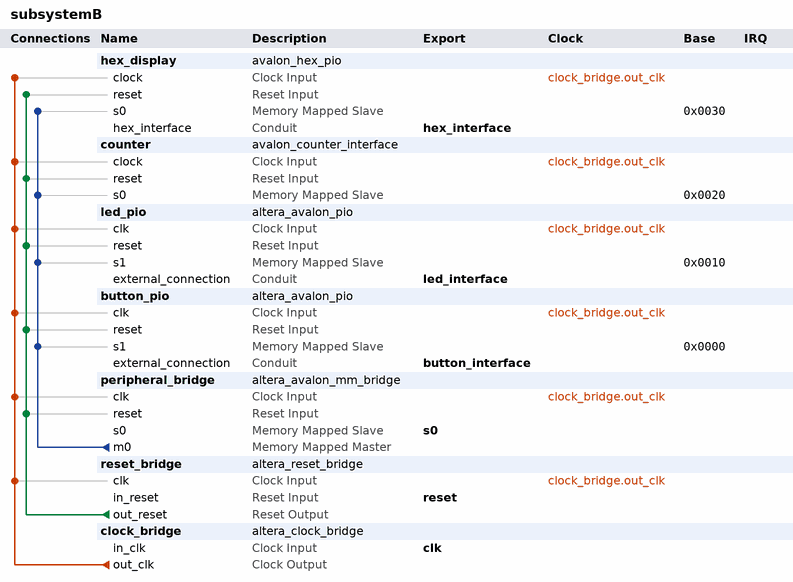
[diagram p0: system contents]
# Platform Designer (Qsys) system subsystemB, MAX 10 10M50DAF484C7G
# Parameters at their usual value, and those the tool derives, are not listed.
package require -exact qsys 18.1
create_system subsystemB
set_project_property DEVICE_FAMILY {MAX 10}
set_project_property DEVICE 10M50DAF484C7G

add_instance hex_display avalon_hex_pio 1.0

add_instance counter avalon_counter_interface 1.0
set_instance_parameter_value counter INITIAL_MAX_COUNT 100
set_instance_parameter_value counter INITIAL_SPEED 5000000

add_instance led_pio altera_avalon_pio 18.1
set_instance_parameter_value led_pio direction Output
set_instance_parameter_value led_pio width 1

add_instance button_pio altera_avalon_pio 18.1
set_instance_parameter_value button_pio direction Input
set_instance_parameter_value button_pio width 2

add_instance peripheral_bridge altera_avalon_mm_bridge 18.1
set_instance_parameter_value peripheral_bridge ADDRESS_UNITS SYMBOLS
set_instance_parameter_value peripheral_bridge ADDRESS_WIDTH 10
set_instance_parameter_value peripheral_bridge DATA_WIDTH 32
set_instance_parameter_value peripheral_bridge MAX_PENDING_RESPONSES 4
set_instance_parameter_value peripheral_bridge USE_AUTO_ADDRESS_WIDTH 0

add_instance reset_bridge altera_reset_bridge 18.1
set_instance_parameter_value reset_bridge ACTIVE_LOW_RESET 0
set_instance_parameter_value reset_bridge SYNCHRONOUS_EDGES deassert

add_instance clock_bridge altera_clock_bridge 18.1
set_instance_parameter_value clock_bridge DERIVED_CLOCK_RATE 0
set_instance_parameter_value clock_bridge EXPLICIT_CLOCK_RATE 0

# connections
add_connection clock_bridge.out_clk button_pio.clk clock
add_connection clock_bridge.out_clk counter.clock clock
add_connection clock_bridge.out_clk hex_display.clock clock
add_connection clock_bridge.out_clk led_pio.clk clock
add_connection clock_bridge.out_clk peripheral_bridge.clk clock
add_connection clock_bridge.out_clk reset_bridge.clk clock
add_connection reset_bridge.out_reset button_pio.reset reset
add_connection reset_bridge.out_reset counter.reset reset
add_connection reset_bridge.out_reset hex_display.reset reset
add_connection reset_bridge.out_reset led_pio.reset reset
add_connection reset_bridge.out_reset peripheral_bridge.reset reset
add_connection peripheral_bridge.m0 button_pio.s1 avalon
set_connection_parameter_value peripheral_bridge.m0/button_pio.s1 baseAddress 0x0000
add_connection peripheral_bridge.m0 counter.s0 avalon
set_connection_parameter_value peripheral_bridge.m0/counter.s0 baseAddress 0x0020
add_connection peripheral_bridge.m0 hex_display.s0 avalon
set_connection_parameter_value peripheral_bridge.m0/hex_display.s0 baseAddress 0x0030
add_connection peripheral_bridge.m0 led_pio.s1 avalon
set_connection_parameter_value peripheral_bridge.m0/led_pio.s1 baseAddress 0x0010

# exported interfaces
add_interface button_interface conduit end
set_interface_property button_interface EXPORT_OF button_pio.external_connection
add_interface clk clock sink
set_interface_property clk EXPORT_OF clock_bridge.in_clk
add_interface hex_interface conduit end
set_interface_property hex_interface EXPORT_OF hex_display.hex_interface
add_interface led_interface conduit end
set_interface_property led_interface EXPORT_OF led_pio.external_connection
add_interface reset reset sink
set_interface_property reset EXPORT_OF reset_bridge.in_reset
add_interface s0 avalon slave
set_interface_property s0 EXPORT_OF peripheral_bridge.s0

set_interconnect_requirement {$system} qsys_mm.clockCrossingAdapter HANDSHAKE
set_interconnect_requirement {$system} qsys_mm.enableEccProtection FALSE
set_interconnect_requirement {$system} qsys_mm.insertDefaultSlave FALSE
set_interconnect_requirement {$system} qsys_mm.maxAdditionalLatency 1

save_system subsystemB.qsys
